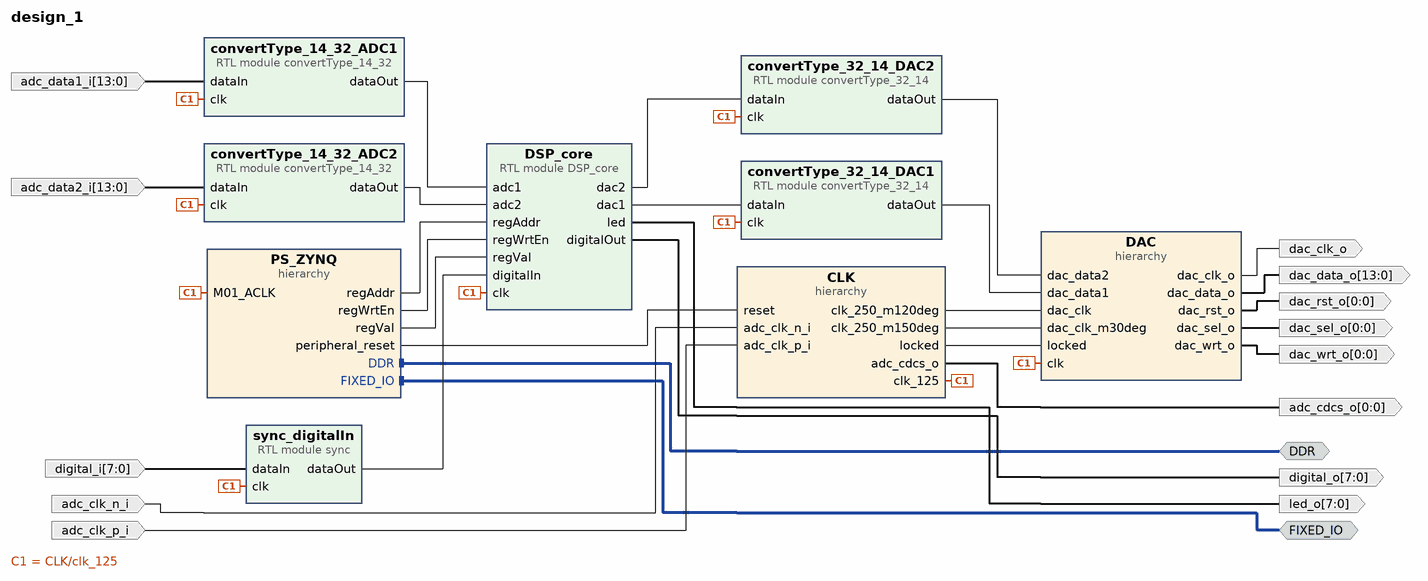
[diagram p0: block diagram of the top level]
# Vivado block design design_1, xc7z010clg400-1, Vivado 2018.3
create_bd_design design_1

create_bd_intf_port -mode Master -vlnv xilinx.com:interface:ddrx_rtl:1.0 DDR
create_bd_intf_port -mode Master -vlnv xilinx.com:display_processing_system7:fixedio_rtl:1.0 FIXED_IO
create_bd_port -dir I -from 13 -to 0 adc_data1_i
create_bd_port -dir I -from 13 -to 0 adc_data2_i
create_bd_port -dir O -from 13 -to 0 dac_data_o
create_bd_port -dir O -from 0 -to 0 dac_wrt_o
create_bd_port -dir O -from 0 -to 0 dac_rst_o
create_bd_port -dir I -type clk adc_clk_p_i
set_property -dict {CONFIG.FREQ_HZ 125000000} [get_bd_ports adc_clk_p_i]
create_bd_port -dir I -type clk adc_clk_n_i
set_property -dict {CONFIG.FREQ_HZ 125000000} [get_bd_ports adc_clk_n_i]
create_bd_port -dir O -from 7 -to 0 led_o
create_bd_port -dir I -from 7 -to 0 digital_i
create_bd_port -dir O -from 7 -to 0 digital_o
create_bd_port -dir O -from 0 -to 0 adc_cdcs_o
create_bd_port -dir O -from 0 -to 0 dac_sel_o
create_bd_port -dir O dac_clk_o

create_bd_cell -type hier CLK
create_bd_cell -type hier PS_ZYNQ
create_bd_cell -type hier DAC
create_bd_cell -type module -reference sync sync_digitalIn
create_bd_cell -type module -reference convertType_14_32 convertType_14_32_ADC1
create_bd_cell -type module -reference convertType_14_32 convertType_14_32_ADC2
create_bd_cell -type module -reference convertType_32_14 convertType_32_14_DAC1
create_bd_cell -type module -reference convertType_32_14 convertType_32_14_DAC2
create_bd_cell -type module -reference DSP_core DSP_core

# ---- hierarchy /CLK ----
current_bd_instance /CLK
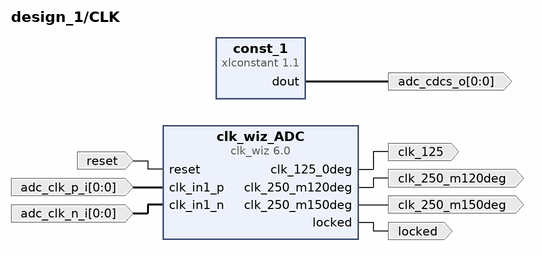
[diagram p1: block diagram inside /CLK]
create_bd_pin -dir O -from 0 -to 0 adc_cdcs_o
create_bd_pin -dir I -type rst reset
create_bd_pin -dir O -type clk clk_125
create_bd_pin -dir I -from 0 -to 0 -type clk adc_clk_p_i
create_bd_pin -dir I -from 0 -to 0 -type clk adc_clk_n_i
create_bd_pin -dir O -type clk clk_250_m120deg
create_bd_pin -dir O -type clk clk_250_m150deg
create_bd_pin -dir O locked

create_bd_cell -type ip -vlnv xilinx.com:ip:xlconstant:1.1 const_1
create_bd_cell -type ip -vlnv xilinx.com:ip:clk_wiz:6.0 clk_wiz_ADC
set_property -dict [list \
  CONFIG.CLKIN1_JITTER_PS 80.0 \
  CONFIG.CLKOUT1_DRIVES BUFG \
  CONFIG.CLKOUT1_JITTER 128.871 \
  CONFIG.CLKOUT1_PHASE_ERROR 112.379 \
  CONFIG.CLKOUT1_REQUESTED_OUT_FREQ 125 \
  CONFIG.CLKOUT1_REQUESTED_PHASE -0 \
  CONFIG.CLKOUT1_USED true \
  CONFIG.CLKOUT2_DRIVES BUFG \
  CONFIG.CLKOUT2_JITTER 112.962 \
  CONFIG.CLKOUT2_PHASE_ERROR 112.379 \
  CONFIG.CLKOUT2_REQUESTED_DUTY_CYCLE 50 \
  CONFIG.CLKOUT2_REQUESTED_OUT_FREQ 250 \
  CONFIG.CLKOUT2_REQUESTED_PHASE -120 \
  CONFIG.CLKOUT2_USED true \
  CONFIG.CLKOUT3_DRIVES BUFG \
  CONFIG.CLKOUT3_JITTER 112.962 \
  CONFIG.CLKOUT3_PHASE_ERROR 112.379 \
  CONFIG.CLKOUT3_REQUESTED_OUT_FREQ 250 \
  CONFIG.CLKOUT3_REQUESTED_PHASE -150 \
  CONFIG.CLKOUT3_USED true \
  CONFIG.CLKOUT4_DRIVES BUFG \
  CONFIG.CLKOUT5_DRIVES BUFG \
  CONFIG.CLKOUT6_DRIVES BUFG \
  CONFIG.CLKOUT7_DRIVES BUFG \
  CONFIG.CLK_OUT1_PORT clk_125_0deg \
  CONFIG.CLK_OUT2_PORT clk_250_m120deg \
  CONFIG.CLK_OUT3_PORT clk_250_m150deg \
  CONFIG.FEEDBACK_SOURCE FDBK_AUTO \
  CONFIG.JITTER_SEL No_Jitter \
  CONFIG.MMCM_BANDWIDTH OPTIMIZED \
  CONFIG.MMCM_CLKFBOUT_MULT_F 6.000 \
  CONFIG.MMCM_CLKIN1_PERIOD 8.000 \
  CONFIG.MMCM_CLKIN2_PERIOD 10.0 \
  CONFIG.MMCM_CLKOUT0_DIVIDE_F 6.000 \
  CONFIG.MMCM_CLKOUT0_PHASE 0.000 \
  CONFIG.MMCM_CLKOUT1_DIVIDE 3 \
  CONFIG.MMCM_CLKOUT1_DUTY_CYCLE 0.500 \
  CONFIG.MMCM_CLKOUT1_PHASE -120.000 \
  CONFIG.MMCM_CLKOUT2_DIVIDE 3 \
  CONFIG.MMCM_CLKOUT2_PHASE -150.000 \
  CONFIG.MMCM_COMPENSATION ZHOLD \
  CONFIG.MMCM_DIVCLK_DIVIDE 1 \
  CONFIG.NUM_OUT_CLKS 3 \
  CONFIG.PRIMITIVE MMCM \
  CONFIG.PRIM_IN_FREQ 125 \
  CONFIG.PRIM_SOURCE Differential_clock_capable_pin \
] [get_bd_cells clk_wiz_ADC]

# ---- hierarchy /PS_ZYNQ ----
current_bd_instance /PS_ZYNQ
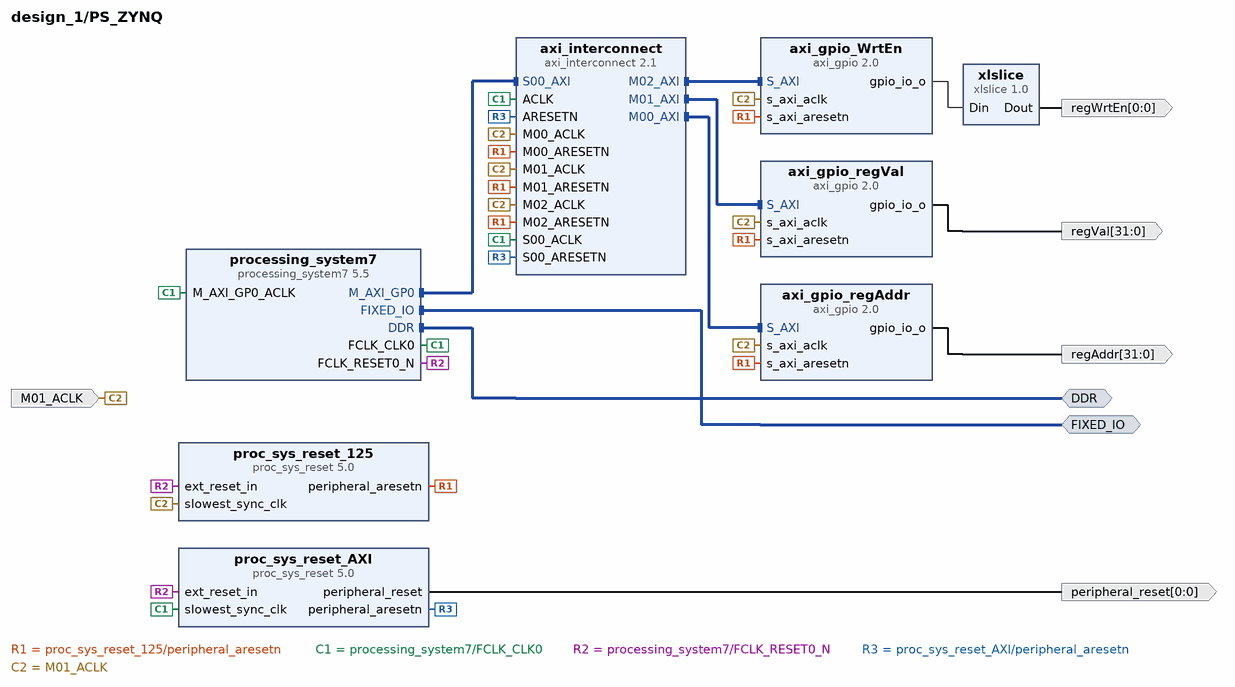
[diagram p2: block diagram inside /PS_ZYNQ]
create_bd_intf_pin -mode Master -vlnv xilinx.com:interface:ddrx_rtl:1.0 DDR
create_bd_intf_pin -mode Master -vlnv xilinx.com:display_processing_system7:fixedio_rtl:1.0 FIXED_IO
create_bd_pin -dir I -type clk M01_ACLK
create_bd_pin -dir O -from 31 -to 0 regAddr
create_bd_pin -dir O -from 0 -to 0 regWrtEn
create_bd_pin -dir O -from 0 -to 0 -type rst peripheral_reset
create_bd_pin -dir O -from 31 -to 0 regVal

create_bd_cell -type ip -vlnv xilinx.com:ip:axi_gpio:2.0 axi_gpio_regAddr
create_bd_cell -type ip -vlnv xilinx.com:ip:xlslice:1.0 xlslice
create_bd_cell -type ip -vlnv xilinx.com:ip:axi_gpio:2.0 axi_gpio_WrtEn
create_bd_cell -type ip -vlnv xilinx.com:ip:proc_sys_reset:5.0 proc_sys_reset_AXI
create_bd_cell -type ip -vlnv xilinx.com:ip:proc_sys_reset:5.0 proc_sys_reset_125
create_bd_cell -type ip -vlnv xilinx.com:ip:axi_gpio:2.0 axi_gpio_regVal
create_bd_cell -type ip -vlnv xilinx.com:ip:processing_system7:5.5 processing_system7
# 1 more settings of processing_system7 are not shown: defaults, MIO pin electricals, DDR timing, and values the tool derives
create_bd_cell -type ip -vlnv xilinx.com:ip:axi_interconnect:2.1 axi_interconnect
set_property -dict {CONFIG.NUM_MI 3} [get_bd_cells axi_interconnect]

# ---- hierarchy /DAC ----
current_bd_instance /DAC
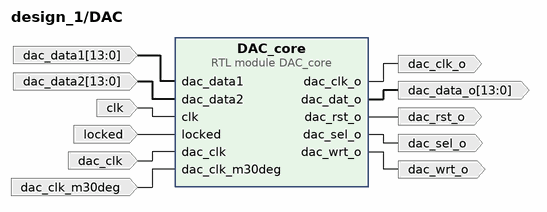
[diagram p3: block diagram inside /DAC]
create_bd_pin -dir I dac_clk
create_bd_pin -dir I dac_clk_m30deg
create_bd_pin -dir I -type clk clk
create_bd_pin -dir O dac_rst_o
create_bd_pin -dir O dac_wrt_o
create_bd_pin -dir O -from 13 -to 0 dac_data_o
create_bd_pin -dir O dac_clk_o
create_bd_pin -dir I -from 13 -to 0 dac_data1
create_bd_pin -dir I -from 13 -to 0 dac_data2
create_bd_pin -dir O dac_sel_o
create_bd_pin -dir I locked

create_bd_cell -type module -reference DAC_core DAC_core

# ---- connections ----

current_bd_instance /CLK
connect_bd_net -net ADC_clk_adc_cdcs_o [get_bd_pins const_1/dout] [get_bd_pins adc_cdcs_o]
connect_bd_net -net PS_ZYNQ_peripheral_reset [get_bd_pins reset] [get_bd_pins clk_wiz_ADC/reset]
connect_bd_net [get_bd_pins clk_wiz_ADC/clk_125_0deg] [get_bd_pins clk_125]
connect_bd_net [get_bd_pins adc_clk_p_i] [get_bd_pins clk_wiz_ADC/clk_in1_p]
connect_bd_net [get_bd_pins adc_clk_n_i] [get_bd_pins clk_wiz_ADC/clk_in1_n]
connect_bd_net [get_bd_pins clk_wiz_ADC/locked] [get_bd_pins locked]
connect_bd_net [get_bd_pins clk_wiz_ADC/clk_250_m120deg] [get_bd_pins clk_250_m120deg]
connect_bd_net [get_bd_pins clk_wiz_ADC/clk_250_m150deg] [get_bd_pins clk_250_m150deg]

current_bd_instance /PS_ZYNQ
connect_bd_intf_net -intf_net processing_system7_0_M_AXI_GP0 [get_bd_intf_pins processing_system7/M_AXI_GP0] [get_bd_intf_pins axi_interconnect/S00_AXI]
connect_bd_intf_net -intf_net axi_interconnect_0_M00_AXI [get_bd_intf_pins axi_interconnect/M00_AXI] [get_bd_intf_pins axi_gpio_regAddr/S_AXI]
connect_bd_intf_net -intf_net axi_interconnect_0_M01_AXI [get_bd_intf_pins axi_interconnect/M01_AXI] [get_bd_intf_pins axi_gpio_regVal/S_AXI]
connect_bd_intf_net -intf_net processing_system7_0_FIXED_IO [get_bd_intf_pins FIXED_IO] [get_bd_intf_pins processing_system7/FIXED_IO]
connect_bd_intf_net -intf_net axi_interconnect_0_M02_AXI [get_bd_intf_pins axi_interconnect/M02_AXI] [get_bd_intf_pins axi_gpio_WrtEn/S_AXI]
connect_bd_intf_net -intf_net processing_system7_0_DDR [get_bd_intf_pins DDR] [get_bd_intf_pins processing_system7/DDR]
connect_bd_net [get_bd_pins proc_sys_reset_125/peripheral_aresetn] \
  [get_bd_pins axi_gpio_WrtEn/s_axi_aresetn] [get_bd_pins axi_gpio_regVal/s_axi_aresetn] \
  [get_bd_pins axi_gpio_regAddr/s_axi_aresetn] [get_bd_pins axi_interconnect/M00_ARESETN] \
  [get_bd_pins axi_interconnect/M01_ARESETN] [get_bd_pins axi_interconnect/M02_ARESETN]
connect_bd_net -net axi_gpio_regValWrtEn_gpio_io_o [get_bd_pins axi_gpio_WrtEn/gpio_io_o] [get_bd_pins xlslice/Din]
connect_bd_net -net processing_system7_0_FCLK_CLK0 [get_bd_pins processing_system7/FCLK_CLK0] \
  [get_bd_pins processing_system7/M_AXI_GP0_ACLK] [get_bd_pins proc_sys_reset_AXI/slowest_sync_clk] \
  [get_bd_pins axi_interconnect/S00_ACLK] [get_bd_pins axi_interconnect/ACLK]
connect_bd_net -net processing_system7_0_FCLK_RESET0_N [get_bd_pins processing_system7/FCLK_RESET0_N] \
  [get_bd_pins proc_sys_reset_AXI/ext_reset_in] [get_bd_pins proc_sys_reset_125/ext_reset_in]
connect_bd_net -net proc_sys_reset_0_peripheral_aresetn [get_bd_pins proc_sys_reset_AXI/peripheral_aresetn] \
  [get_bd_pins axi_interconnect/ARESETN] [get_bd_pins axi_interconnect/S00_ARESETN]
connect_bd_net -net ADC_and_DAC_clk_clk_out1 [get_bd_pins M01_ACLK] \
  [get_bd_pins axi_interconnect/M01_ACLK] [get_bd_pins axi_interconnect/M02_ACLK] [get_bd_pins axi_interconnect/M00_ACLK] \
  [get_bd_pins axi_gpio_regVal/s_axi_aclk] [get_bd_pins axi_gpio_WrtEn/s_axi_aclk] \
  [get_bd_pins proc_sys_reset_125/slowest_sync_clk] [get_bd_pins axi_gpio_regAddr/s_axi_aclk]
connect_bd_net -net PS_ZYNQ_gpio_io_o [get_bd_pins axi_gpio_regAddr/gpio_io_o] [get_bd_pins regAddr]
connect_bd_net -net PS_ZYNQ_Dout [get_bd_pins xlslice/Dout] [get_bd_pins regWrtEn]
connect_bd_net -net PS_ZYNQ_peripheral_reset [get_bd_pins proc_sys_reset_AXI/peripheral_reset] [get_bd_pins peripheral_reset]
connect_bd_net -net PS_ZYNQ_gpio_io_o1 [get_bd_pins axi_gpio_regVal/gpio_io_o] [get_bd_pins regVal]

current_bd_instance /DAC
connect_bd_net [get_bd_pins DAC_core/dac_rst_o] [get_bd_pins dac_rst_o]
connect_bd_net [get_bd_pins DAC_core/dac_wrt_o] [get_bd_pins dac_wrt_o]
connect_bd_net [get_bd_pins DAC_core/dac_dat_o] [get_bd_pins dac_data_o]
connect_bd_net [get_bd_pins DAC_core/dac_clk_o] [get_bd_pins dac_clk_o]
connect_bd_net -net dac_data1_1 [get_bd_pins dac_data1] [get_bd_pins DAC_core/dac_data1]
connect_bd_net -net dac_data2_1 [get_bd_pins dac_data2] [get_bd_pins DAC_core/dac_data2]
connect_bd_net [get_bd_pins DAC_core/dac_sel_o] [get_bd_pins dac_sel_o]
connect_bd_net [get_bd_pins clk] [get_bd_pins DAC_core/clk]
connect_bd_net [get_bd_pins locked] [get_bd_pins DAC_core/locked]
connect_bd_net [get_bd_pins dac_clk] [get_bd_pins DAC_core/dac_clk]
connect_bd_net [get_bd_pins dac_clk_m30deg] [get_bd_pins DAC_core/dac_clk_m30deg]

current_bd_instance /
connect_bd_intf_net -intf_net processing_system7_0_DDR [get_bd_intf_ports DDR] [get_bd_intf_pins PS_ZYNQ/DDR]
connect_bd_intf_net -intf_net processing_system7_0_FIXED_IO [get_bd_intf_ports FIXED_IO] [get_bd_intf_pins PS_ZYNQ/FIXED_IO]
connect_bd_net -net ADC_clk_adc_cdcs_o [get_bd_pins CLK/adc_cdcs_o] [get_bd_ports adc_cdcs_o]
connect_bd_net [get_bd_ports adc_clk_n_i] [get_bd_pins CLK/adc_clk_n_i]
connect_bd_net [get_bd_ports adc_clk_p_i] [get_bd_pins CLK/adc_clk_p_i]
connect_bd_net -net ADC_and_DAC_clk_clk_out1 [get_bd_pins CLK/clk_125] \
  [get_bd_pins PS_ZYNQ/M01_ACLK] [get_bd_pins sync_digitalIn/clk] [get_bd_pins convertType_14_32_ADC1/clk] \
  [get_bd_pins convertType_14_32_ADC2/clk] [get_bd_pins convertType_32_14_DAC1/clk] [get_bd_pins convertType_32_14_DAC2/clk] \
  [get_bd_pins DAC/clk] [get_bd_pins DSP_core/clk]
connect_bd_net [get_bd_pins PS_ZYNQ/peripheral_reset] [get_bd_pins CLK/reset]
connect_bd_net [get_bd_ports adc_data1_i] [get_bd_pins convertType_14_32_ADC1/dataIn]
connect_bd_net [get_bd_ports adc_data2_i] [get_bd_pins convertType_14_32_ADC2/dataIn]
connect_bd_net [get_bd_ports digital_i] [get_bd_pins sync_digitalIn/dataIn]
connect_bd_net [get_bd_pins PS_ZYNQ/regAddr] [get_bd_pins DSP_core/regAddr]
connect_bd_net [get_bd_pins PS_ZYNQ/regWrtEn] [get_bd_pins DSP_core/regWrtEn]
connect_bd_net [get_bd_pins PS_ZYNQ/regVal] [get_bd_pins DSP_core/regVal]
connect_bd_net [get_bd_pins convertType_14_32_ADC1/dataOut] [get_bd_pins DSP_core/adc1]
connect_bd_net [get_bd_pins convertType_14_32_ADC2/dataOut] [get_bd_pins DSP_core/adc2]
connect_bd_net [get_bd_pins sync_digitalIn/dataOut] [get_bd_pins DSP_core/digitalIn]
connect_bd_net -net DSP_core_0_led [get_bd_pins DSP_core/led] [get_bd_ports led_o]
connect_bd_net -net DSP_core_0_digitalOut [get_bd_pins DSP_core/digitalOut] [get_bd_ports digital_o]
connect_bd_net -net DSP_core_0_dac1 [get_bd_pins DSP_core/dac1] [get_bd_pins convertType_32_14_DAC1/dataIn]
connect_bd_net -net DSP_core_0_dac2 [get_bd_pins DSP_core/dac2] [get_bd_pins convertType_32_14_DAC2/dataIn]
connect_bd_net -net CLK_clk_250_0deg [get_bd_pins CLK/clk_250_m120deg] [get_bd_pins DAC/dac_clk]
connect_bd_net [get_bd_pins CLK/clk_250_m150deg] [get_bd_pins DAC/dac_clk_m30deg]
connect_bd_net [get_bd_pins DAC/dac_rst_o] [get_bd_ports dac_rst_o]
connect_bd_net [get_bd_pins DAC/dac_wrt_o] [get_bd_ports dac_wrt_o]
connect_bd_net [get_bd_pins DAC/dac_data_o] [get_bd_ports dac_data_o]
connect_bd_net [get_bd_pins DAC/dac_clk_o] [get_bd_ports dac_clk_o]
connect_bd_net [get_bd_pins convertType_32_14_DAC1/dataOut] [get_bd_pins DAC/dac_data1]
connect_bd_net [get_bd_pins convertType_32_14_DAC2/dataOut] [get_bd_pins DAC/dac_data2]
connect_bd_net [get_bd_pins DAC/dac_sel_o] [get_bd_ports dac_sel_o]
connect_bd_net [get_bd_pins CLK/locked] [get_bd_pins DAC/locked]

# ---- address map ----
assign_bd_address -offset 0x41200000 -range 64K -target_address_space [get_bd_addr_spaces PS_ZYNQ/processing_system7/Data] [get_bd_addr_segs PS_ZYNQ/axi_gpio_regAddr/S_AXI/Reg]
assign_bd_address -offset 0x41210000 -range 64K -target_address_space [get_bd_addr_spaces PS_ZYNQ/processing_system7/Data] [get_bd_addr_segs PS_ZYNQ/axi_gpio_WrtEn/S_AXI/Reg]
assign_bd_address -offset 0x41220000 -range 64K -target_address_space [get_bd_addr_spaces PS_ZYNQ/processing_system7/Data] [get_bd_addr_segs PS_ZYNQ/axi_gpio_regVal/S_AXI/Reg]

validate_bd_design
save_bd_design
